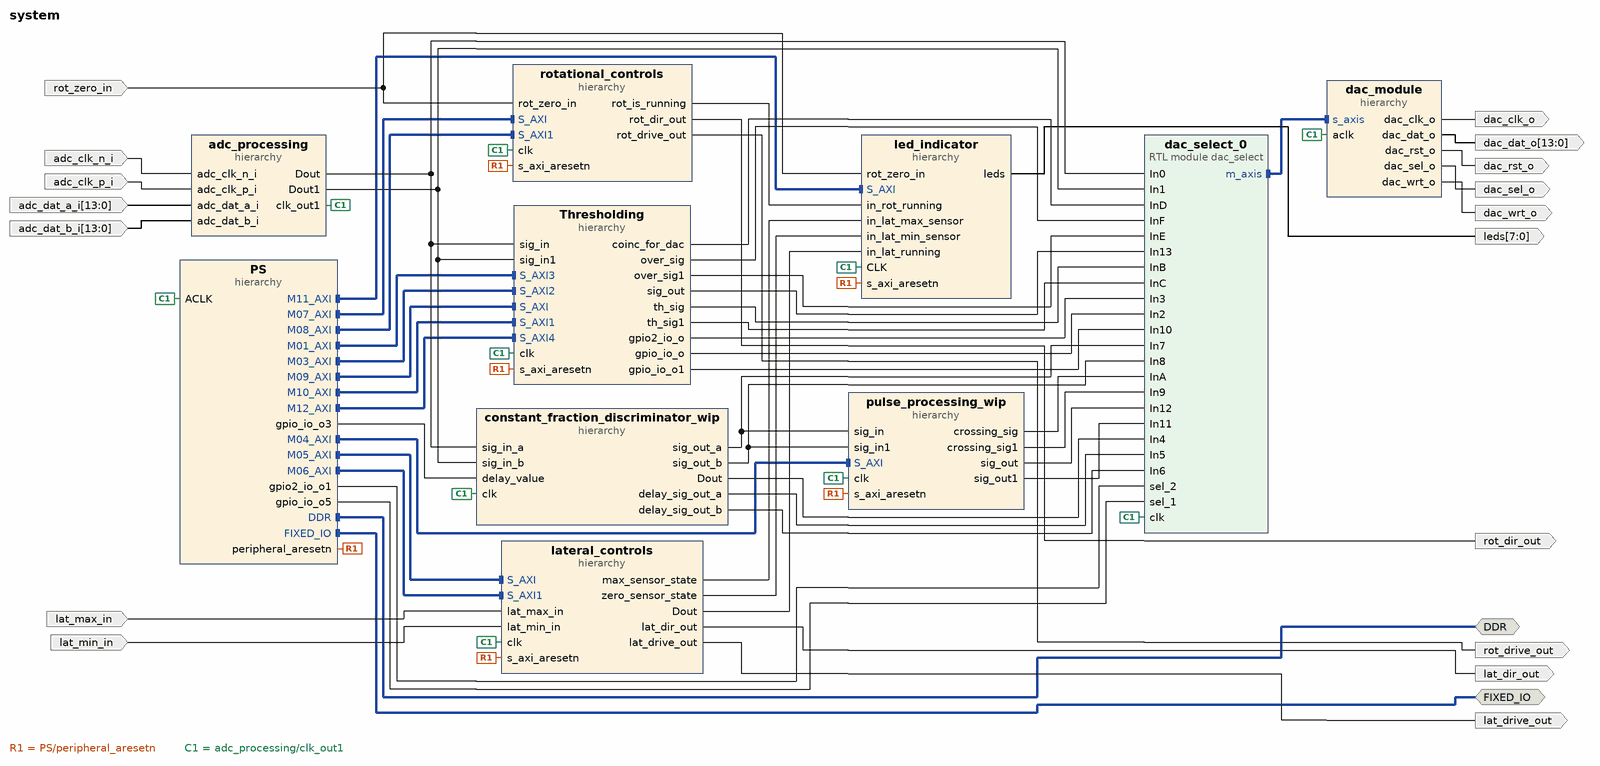
[diagram p0: block diagram of the top level]
# Vivado block design system, xc7z010clg400-1, Vivado 2024.1
create_bd_design system

create_bd_intf_port -mode Master -vlnv xilinx.com:interface:ddrx_rtl:1.0 DDR
create_bd_intf_port -mode Master -vlnv xilinx.com:display_processing_system7:fixedio_rtl:1.0 FIXED_IO
create_bd_port -dir O dac_clk_o
create_bd_port -dir O dac_rst_o
create_bd_port -dir O dac_sel_o
create_bd_port -dir O dac_wrt_o
create_bd_port -dir O -from 13 -to 0 dac_dat_o
create_bd_port -dir I -from 13 -to 0 adc_dat_a_i
create_bd_port -dir I -from 13 -to 0 adc_dat_b_i
create_bd_port -dir I -type clk adc_clk_p_i
set_property -dict {CONFIG.FREQ_HZ 125000000} [get_bd_ports adc_clk_p_i]
create_bd_port -dir I -type clk adc_clk_n_i
set_property -dict {CONFIG.FREQ_HZ 125000000} [get_bd_ports adc_clk_n_i]
create_bd_port -dir I lat_max_in
create_bd_port -dir I lat_min_in
create_bd_port -dir O lat_drive_out
create_bd_port -dir O lat_dir_out
create_bd_port -dir O -from 7 -to 0 leds
create_bd_port -dir O rot_drive_out
create_bd_port -dir O rot_dir_out
create_bd_port -dir I rot_zero_in

create_bd_cell -type hier dac_module
create_bd_cell -type hier constant_fraction_discriminator_wip
create_bd_cell -type hier Thresholding
create_bd_cell -type hier PS
create_bd_cell -type module -reference dac_select dac_select_0
set_property -dict {CONFIG.CHANNELS_IN 16} [get_bd_cells dac_select_0]
create_bd_cell -type hier lateral_controls
create_bd_cell -type hier rotational_controls
create_bd_cell -type hier pulse_processing_wip
create_bd_cell -type hier adc_processing
create_bd_cell -type hier led_indicator

# ---- hierarchy /dac_module ----
current_bd_instance /dac_module
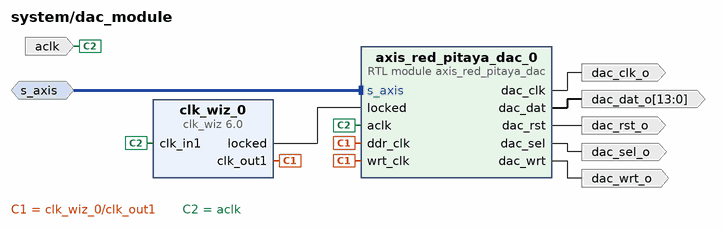
[diagram p1: block diagram inside /dac_module]
create_bd_intf_pin -mode Slave -vlnv xilinx.com:interface:axis_rtl:1.0 s_axis
create_bd_pin -dir I -type clk aclk
create_bd_pin -dir O -type clk dac_clk_o
create_bd_pin -dir O -type rst dac_rst_o
create_bd_pin -dir O dac_sel_o
create_bd_pin -dir O dac_wrt_o
create_bd_pin -dir O -from 13 -to 0 dac_dat_o

create_bd_cell -type ip -vlnv xilinx.com:ip:clk_wiz:6.0 clk_wiz_0
set_property -dict [list \
  CONFIG.CLKIN1_JITTER_PS 80.0 \
  CONFIG.CLKOUT1_DRIVES BUFG \
  CONFIG.CLKOUT1_JITTER 104.759 \
  CONFIG.CLKOUT1_PHASE_ERROR 96.948 \
  CONFIG.CLKOUT1_REQUESTED_OUT_FREQ 250 \
  CONFIG.CLKOUT2_DRIVES BUFG \
  CONFIG.CLKOUT3_DRIVES BUFG \
  CONFIG.CLKOUT4_DRIVES BUFG \
  CONFIG.CLKOUT5_DRIVES BUFG \
  CONFIG.CLKOUT6_DRIVES BUFG \
  CONFIG.CLKOUT7_DRIVES BUFG \
  CONFIG.FEEDBACK_SOURCE FDBK_AUTO \
  CONFIG.MMCM_BANDWIDTH OPTIMIZED \
  CONFIG.MMCM_CLKFBOUT_MULT_F 8.000 \
  CONFIG.MMCM_CLKIN1_PERIOD 8.000 \
  CONFIG.MMCM_CLKIN2_PERIOD 10.000 \
  CONFIG.MMCM_CLKOUT0_DIVIDE_F 4.000 \
  CONFIG.MMCM_COMPENSATION ZHOLD \
  CONFIG.PRIMITIVE MMCM \
  CONFIG.PRIM_IN_FREQ 125 \
  CONFIG.USE_RESET false \
] [get_bd_cells clk_wiz_0]
create_bd_cell -type module -reference axis_red_pitaya_dac axis_red_pitaya_dac_0

# ---- hierarchy /constant_fraction_discriminator_wip ----
current_bd_instance /constant_fraction_discriminator_wip
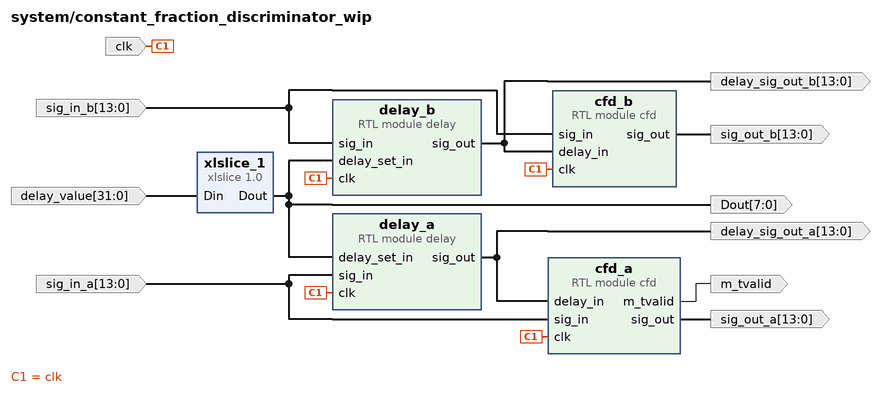
[diagram p2: block diagram inside /constant_fraction_discriminator_wip]
create_bd_pin -dir I -type clk clk
create_bd_pin -dir I -from 13 -to 0 sig_in_a
create_bd_pin -dir O -from 13 -to 0 sig_out_a
create_bd_pin -dir O m_tvalid
create_bd_pin -dir I -from 31 -to 0 delay_value
create_bd_pin -dir I -from 13 -to 0 sig_in_b
create_bd_pin -dir O -from 13 -to 0 sig_out_b
create_bd_pin -dir O -from 7 -to 0 Dout
create_bd_pin -dir O -from 13 -to 0 delay_sig_out_a
create_bd_pin -dir O -from 13 -to 0 delay_sig_out_b

create_bd_cell -type module -reference cfd cfd_a
create_bd_cell -type module -reference delay delay_a
create_bd_cell -type ip -vlnv xilinx.com:ip:xlslice:1.0 xlslice_1
set_property -dict {CONFIG.DIN_FROM 7 CONFIG.DOUT_WIDTH 8} [get_bd_cells xlslice_1]
create_bd_cell -type module -reference delay delay_b
create_bd_cell -type module -reference cfd cfd_b

# ---- hierarchy /Thresholding ----
current_bd_instance /Thresholding
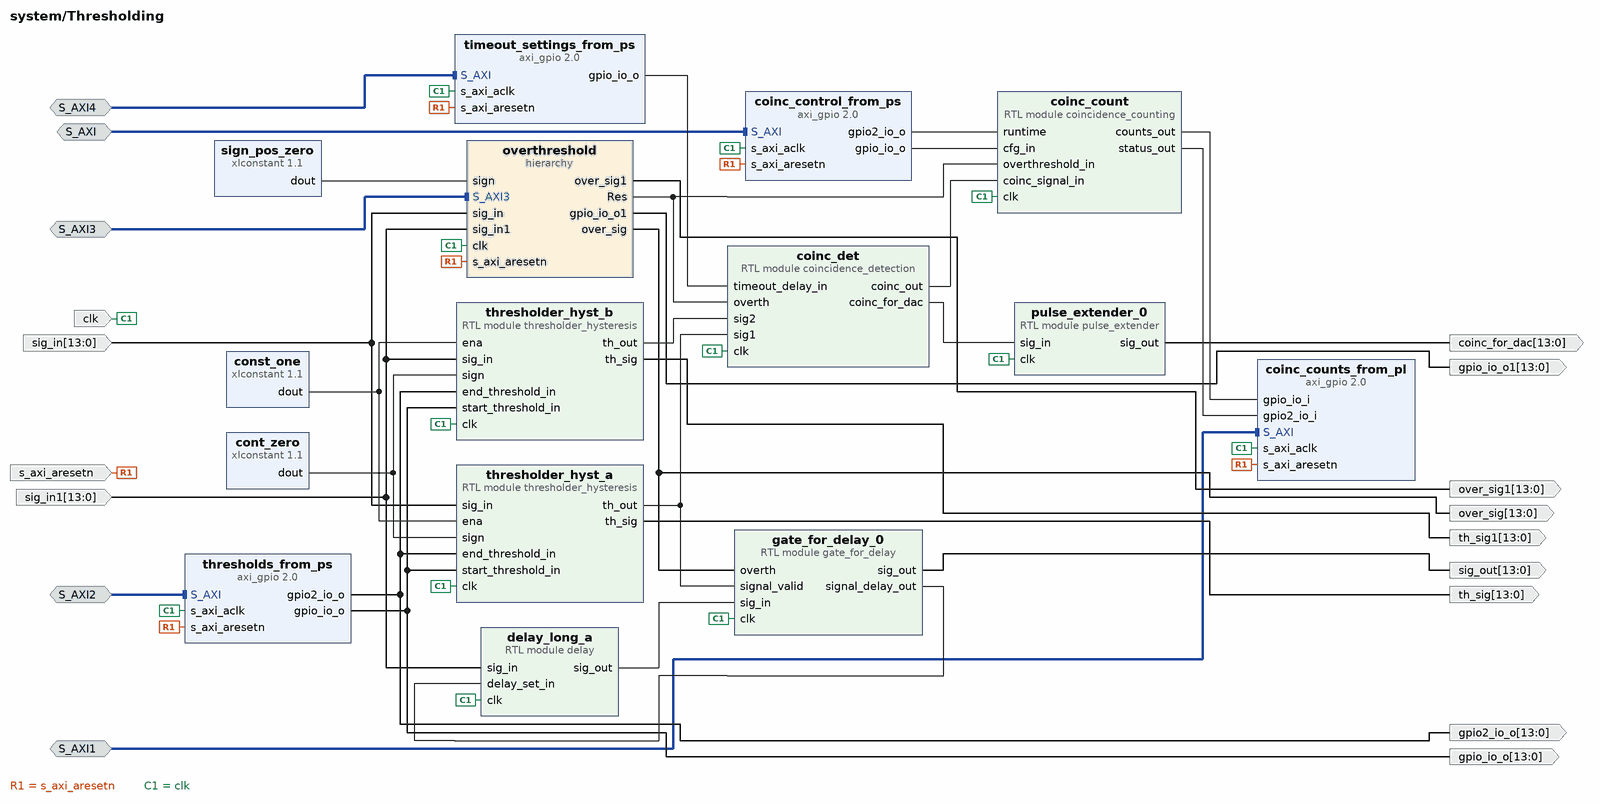
[diagram p3: block diagram inside /Thresholding]
create_bd_intf_pin -mode Slave -vlnv xilinx.com:interface:aximm_rtl:1.0 S_AXI
create_bd_intf_pin -mode Slave -vlnv xilinx.com:interface:aximm_rtl:1.0 S_AXI1
create_bd_intf_pin -mode Slave -vlnv xilinx.com:interface:aximm_rtl:1.0 S_AXI2
create_bd_intf_pin -mode Slave -vlnv xilinx.com:interface:aximm_rtl:1.0 S_AXI3
create_bd_intf_pin -mode Slave -vlnv xilinx.com:interface:aximm_rtl:1.0 S_AXI4
create_bd_pin -dir I -type clk clk
create_bd_pin -dir I -from 13 -to 0 sig_in
create_bd_pin -dir O -from 13 -to 0 th_sig
create_bd_pin -dir I -from 13 -to 0 sig_in1
create_bd_pin -dir O -from 13 -to 0 th_sig1
create_bd_pin -dir O -from 13 -to 0 coinc_for_dac
create_bd_pin -dir O -from 13 -to 0 over_sig
create_bd_pin -dir O -from 13 -to 0 over_sig1
create_bd_pin -dir I -type rst s_axi_aresetn
create_bd_pin -dir O -from 13 -to 0 sig_out
create_bd_pin -dir O -from 13 -to 0 gpio_io_o
create_bd_pin -dir O -from 13 -to 0 gpio2_io_o
create_bd_pin -dir O -from 13 -to 0 gpio_io_o1

create_bd_cell -type ip -vlnv xilinx.com:ip:xlconstant:1.1 const_one
create_bd_cell -type module -reference thresholder_hysteresis thresholder_hyst_a
create_bd_cell -type module -reference thresholder_hysteresis thresholder_hyst_b
create_bd_cell -type ip -vlnv xilinx.com:ip:xlconstant:1.1 cont_zero
set_property -dict {CONFIG.CONST_VAL 0} [get_bd_cells cont_zero]
create_bd_cell -type module -reference coincidence_detection coinc_det
create_bd_cell -type module -reference pulse_extender pulse_extender_0
create_bd_cell -type hier overthreshold
create_bd_cell -type module -reference coincidence_counting coinc_count
create_bd_cell -type ip -vlnv xilinx.com:ip:axi_gpio:2.0 coinc_control_from_ps
set_property -dict {CONFIG.C_ALL_OUTPUTS 1 CONFIG.C_ALL_OUTPUTS_2 1 CONFIG.C_IS_DUAL 1} [get_bd_cells coinc_control_from_ps]
create_bd_cell -type ip -vlnv xilinx.com:ip:axi_gpio:2.0 coinc_counts_from_pl
set_property -dict {CONFIG.C_ALL_INPUTS 1 CONFIG.C_ALL_INPUTS_2 1 CONFIG.C_IS_DUAL 1} [get_bd_cells coinc_counts_from_pl]
create_bd_cell -type module -reference delay delay_long_a
create_bd_cell -type module -reference gate_for_delay gate_for_delay_0
set_property -dict {CONFIG.DELAY_VALUE 500} [get_bd_cells gate_for_delay_0]
create_bd_cell -type ip -vlnv xilinx.com:ip:xlconstant:1.1 sign_pos_zero
set_property -dict {CONFIG.CONST_VAL 0} [get_bd_cells sign_pos_zero]
create_bd_cell -type ip -vlnv xilinx.com:ip:axi_gpio:2.0 thresholds_from_ps
set_property -dict [list \
  CONFIG.C_ALL_OUTPUTS 1 \
  CONFIG.C_ALL_OUTPUTS_2 1 \
  CONFIG.C_DOUT_DEFAULT 0x00000FFF \
  CONFIG.C_DOUT_DEFAULT_2 0x00000EFF \
  CONFIG.C_GPIO2_WIDTH 14 \
  CONFIG.C_GPIO_WIDTH 14 \
  CONFIG.C_IS_DUAL 1 \
] [get_bd_cells thresholds_from_ps]
create_bd_cell -type ip -vlnv xilinx.com:ip:axi_gpio:2.0 timeout_settings_from_ps
set_property -dict [list \
  CONFIG.C_ALL_OUTPUTS 1 \
  CONFIG.C_DOUT_DEFAULT 0x0000000F \
  CONFIG.C_GPIO_WIDTH 8 \
] [get_bd_cells timeout_settings_from_ps]

# ---- hierarchy /Thresholding/overthreshold ----
current_bd_instance /Thresholding/overthreshold
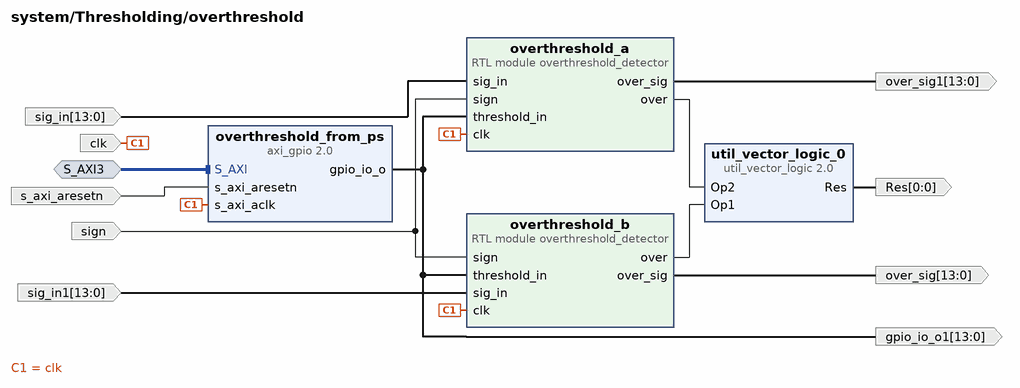
[diagram p4: block diagram inside /Thresholding/overthreshold]
create_bd_intf_pin -mode Slave -vlnv xilinx.com:interface:aximm_rtl:1.0 S_AXI3
create_bd_pin -dir I -type clk clk
create_bd_pin -dir I -from 13 -to 0 sig_in1
create_bd_pin -dir I sign
create_bd_pin -dir O -from 13 -to 0 over_sig
create_bd_pin -dir O -from 0 -to 0 Res
create_bd_pin -dir I -from 13 -to 0 sig_in
create_bd_pin -dir O -from 13 -to 0 over_sig1
create_bd_pin -dir I -type rst s_axi_aresetn
create_bd_pin -dir O -from 13 -to 0 gpio_io_o1

create_bd_cell -type module -reference overthreshold_detector overthreshold_b
create_bd_cell -type ip -vlnv xilinx.com:ip:util_vector_logic:2.0 util_vector_logic_0
set_property -dict {CONFIG.C_OPERATION or CONFIG.C_SIZE 1} [get_bd_cells util_vector_logic_0]
create_bd_cell -type module -reference overthreshold_detector overthreshold_a
create_bd_cell -type ip -vlnv xilinx.com:ip:axi_gpio:2.0 overthreshold_from_ps
set_property -dict [list \
  CONFIG.C_ALL_OUTPUTS 1 \
  CONFIG.C_DOUT_DEFAULT 0x00001E00 \
  CONFIG.C_GPIO_WIDTH 14 \
] [get_bd_cells overthreshold_from_ps]

# ---- hierarchy /PS ----
current_bd_instance /PS
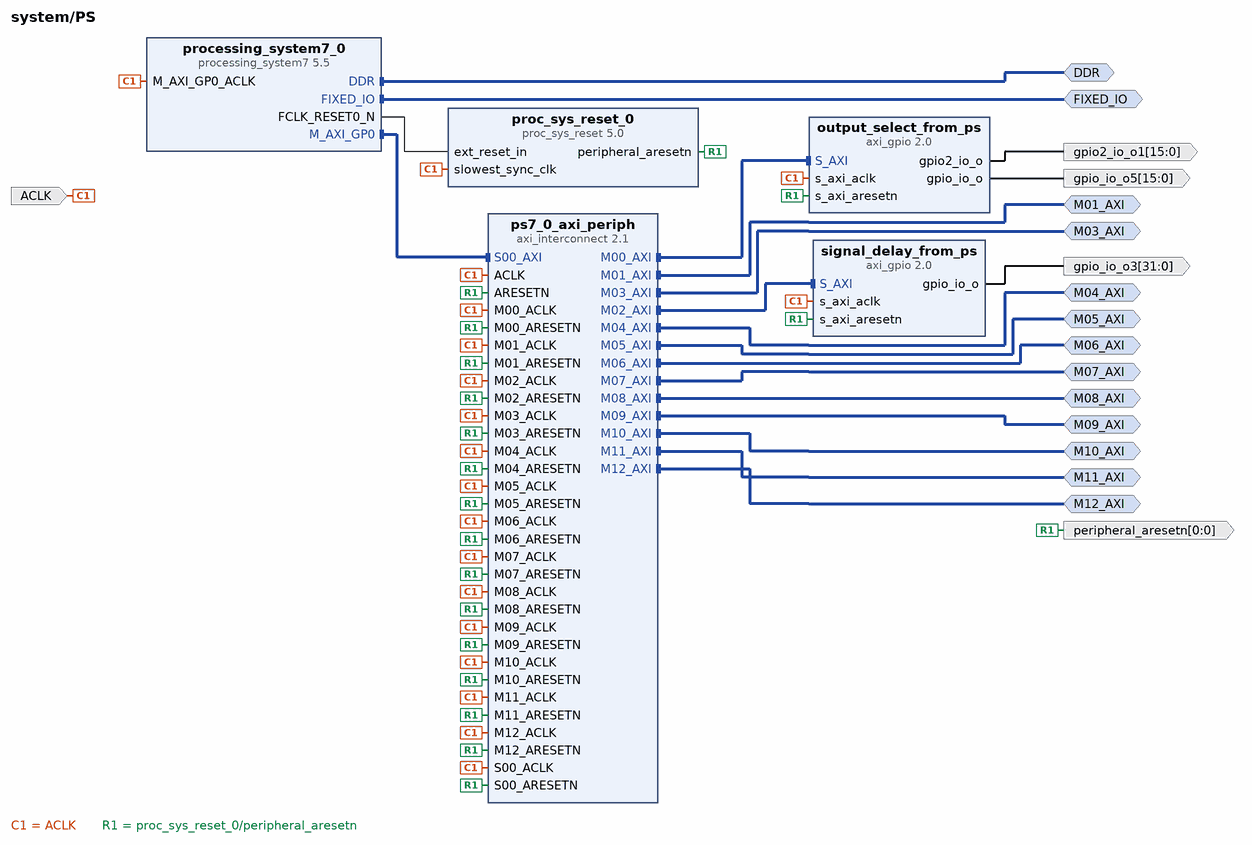
[diagram p5: block diagram inside /PS]
create_bd_intf_pin -mode Master -vlnv xilinx.com:interface:ddrx_rtl:1.0 DDR
create_bd_intf_pin -mode Master -vlnv xilinx.com:display_processing_system7:fixedio_rtl:1.0 FIXED_IO
create_bd_intf_pin -mode Master -vlnv xilinx.com:interface:aximm_rtl:1.0 M05_AXI
create_bd_intf_pin -mode Master -vlnv xilinx.com:interface:aximm_rtl:1.0 M06_AXI
create_bd_intf_pin -mode Master -vlnv xilinx.com:interface:aximm_rtl:1.0 M07_AXI
create_bd_intf_pin -mode Master -vlnv xilinx.com:interface:aximm_rtl:1.0 M08_AXI
create_bd_intf_pin -mode Master -vlnv xilinx.com:interface:aximm_rtl:1.0 M09_AXI
create_bd_intf_pin -mode Master -vlnv xilinx.com:interface:aximm_rtl:1.0 M10_AXI
create_bd_intf_pin -mode Master -vlnv xilinx.com:interface:aximm_rtl:1.0 M04_AXI
create_bd_intf_pin -mode Master -vlnv xilinx.com:interface:aximm_rtl:1.0 M11_AXI
create_bd_intf_pin -mode Master -vlnv xilinx.com:interface:aximm_rtl:1.0 M03_AXI
create_bd_intf_pin -mode Master -vlnv xilinx.com:interface:aximm_rtl:1.0 M01_AXI
create_bd_intf_pin -mode Master -vlnv xilinx.com:interface:aximm_rtl:1.0 M12_AXI
create_bd_pin -dir O -from 31 -to 0 gpio_io_o3
create_bd_pin -dir I -type clk ACLK
create_bd_pin -dir O -from 0 -to 0 -type rst peripheral_aresetn
create_bd_pin -dir O -from 15 -to 0 gpio2_io_o1
create_bd_pin -dir O -from 15 -to 0 gpio_io_o5

create_bd_cell -type ip -vlnv xilinx.com:ip:proc_sys_reset:5.0 proc_sys_reset_0
create_bd_cell -type ip -vlnv xilinx.com:ip:axi_gpio:2.0 output_select_from_ps
set_property -dict [list \
  CONFIG.C_ALL_OUTPUTS 1 \
  CONFIG.C_ALL_OUTPUTS_2 1 \
  CONFIG.C_DOUT_DEFAULT 0x00000000 \
  CONFIG.C_DOUT_DEFAULT_2 0x00000001 \
  CONFIG.C_GPIO2_WIDTH 16 \
  CONFIG.C_GPIO_WIDTH 16 \
  CONFIG.C_IS_DUAL 1 \
] [get_bd_cells output_select_from_ps]
create_bd_cell -type ip -vlnv xilinx.com:ip:processing_system7:5.5 processing_system7_0
set_property -dict [list \
  CONFIG.PCW_FPGA0_PERIPHERAL_FREQMHZ 125 \
  CONFIG.PCW_UIPARAM_DDR_FREQ_MHZ 533.333333 \
  CONFIG.PCW_UIPARAM_DDR_MEMORY_TYPE {DDR 3 (Low Voltage)} \
  CONFIG.PCW_UIPARAM_DDR_PARTNO {MT41K256M16 RE-125} \
] [get_bd_cells processing_system7_0]
# 34 more settings of processing_system7_0 are not shown: defaults, MIO pin electricals, DDR timing, and values the tool derives
create_bd_cell -type ip -vlnv xilinx.com:ip:axi_gpio:2.0 signal_delay_from_ps
set_property -dict [list \
  CONFIG.C_DOUT_DEFAULT 0x00000003 \
  CONFIG.C_IS_DUAL 0 \
  CONFIG.GPIO_BOARD_INTERFACE Custom \
  CONFIG.USE_BOARD_FLOW true \
] [get_bd_cells signal_delay_from_ps]
create_bd_cell -type ip -vlnv xilinx.com:ip:axi_interconnect:2.1 ps7_0_axi_periph
set_property -dict {CONFIG.NUM_MI 13} [get_bd_cells ps7_0_axi_periph]

# ---- hierarchy /lateral_controls ----
current_bd_instance /lateral_controls
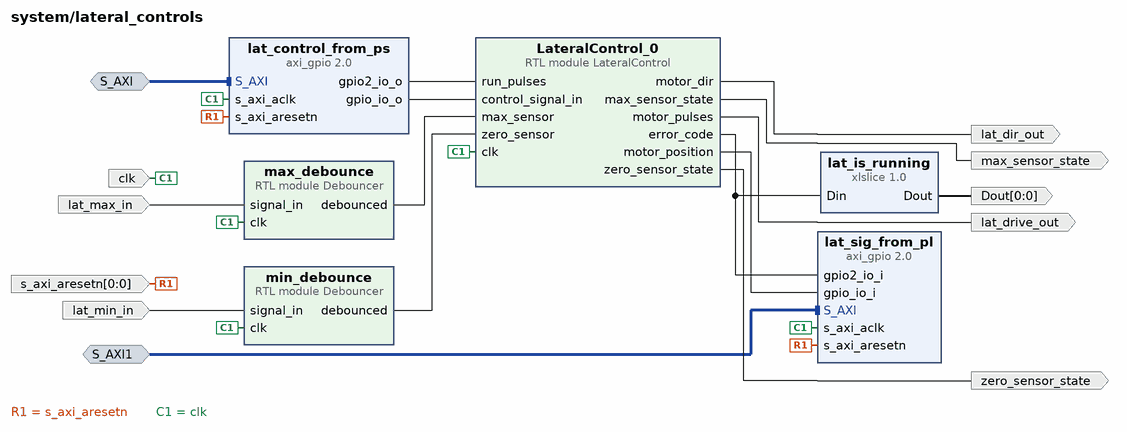
[diagram p6: block diagram inside /lateral_controls]
create_bd_intf_pin -mode Slave -vlnv xilinx.com:interface:aximm_rtl:1.0 S_AXI
create_bd_intf_pin -mode Slave -vlnv xilinx.com:interface:aximm_rtl:1.0 S_AXI1
create_bd_pin -dir I -type clk clk
create_bd_pin -dir O lat_drive_out
create_bd_pin -dir O lat_dir_out
create_bd_pin -dir O max_sensor_state
create_bd_pin -dir O zero_sensor_state
create_bd_pin -dir I lat_min_in
create_bd_pin -dir I lat_max_in
create_bd_pin -dir I -from 0 -to 0 -type rst s_axi_aresetn
create_bd_pin -dir O -from 0 -to 0 Dout

create_bd_cell -type module -reference LateralControl LateralControl_0
create_bd_cell -type module -reference Debouncer min_debounce
create_bd_cell -type module -reference Debouncer max_debounce
create_bd_cell -type ip -vlnv xilinx.com:ip:axi_gpio:2.0 lat_control_from_ps
set_property -dict {CONFIG.C_ALL_OUTPUTS 1 CONFIG.C_ALL_OUTPUTS_2 1 CONFIG.C_IS_DUAL 1} [get_bd_cells lat_control_from_ps]
create_bd_cell -type ip -vlnv xilinx.com:ip:axi_gpio:2.0 lat_sig_from_pl
set_property -dict [list \
  CONFIG.C_ALL_INPUTS 1 \
  CONFIG.C_ALL_INPUTS_2 1 \
  CONFIG.C_GPIO2_WIDTH 8 \
  CONFIG.C_IS_DUAL 1 \
] [get_bd_cells lat_sig_from_pl]
create_bd_cell -type ip -vlnv xilinx.com:ip:xlslice:1.0 lat_is_running
set_property -dict {CONFIG.DIN_WIDTH 8} [get_bd_cells lat_is_running]

# ---- hierarchy /rotational_controls ----
current_bd_instance /rotational_controls
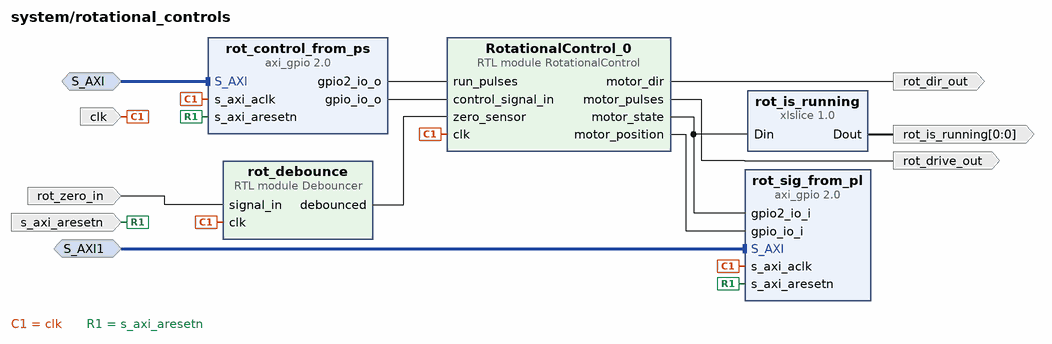
[diagram p7: block diagram inside /rotational_controls]
create_bd_intf_pin -mode Slave -vlnv xilinx.com:interface:aximm_rtl:1.0 S_AXI
create_bd_intf_pin -mode Slave -vlnv xilinx.com:interface:aximm_rtl:1.0 S_AXI1
create_bd_pin -dir O rot_dir_out
create_bd_pin -dir O rot_drive_out
create_bd_pin -dir I -type clk clk
create_bd_pin -dir I -type rst s_axi_aresetn
create_bd_pin -dir I rot_zero_in
create_bd_pin -dir O -from 0 -to 0 rot_is_running

create_bd_cell -type module -reference RotationalControl RotationalControl_0
create_bd_cell -type ip -vlnv xilinx.com:ip:axi_gpio:2.0 rot_control_from_ps
set_property -dict {CONFIG.C_ALL_OUTPUTS 1 CONFIG.C_ALL_OUTPUTS_2 1 CONFIG.C_IS_DUAL 1} [get_bd_cells rot_control_from_ps]
create_bd_cell -type ip -vlnv xilinx.com:ip:axi_gpio:2.0 rot_sig_from_pl
set_property -dict [list \
  CONFIG.C_ALL_INPUTS 1 \
  CONFIG.C_ALL_INPUTS_2 1 \
  CONFIG.C_GPIO2_WIDTH 7 \
  CONFIG.C_IS_DUAL 1 \
] [get_bd_cells rot_sig_from_pl]
create_bd_cell -type module -reference Debouncer rot_debounce
create_bd_cell -type ip -vlnv xilinx.com:ip:xlslice:1.0 rot_is_running
set_property -dict {CONFIG.DIN_WIDTH 6} [get_bd_cells rot_is_running]

# ---- hierarchy /pulse_processing_wip ----
current_bd_instance /pulse_processing_wip
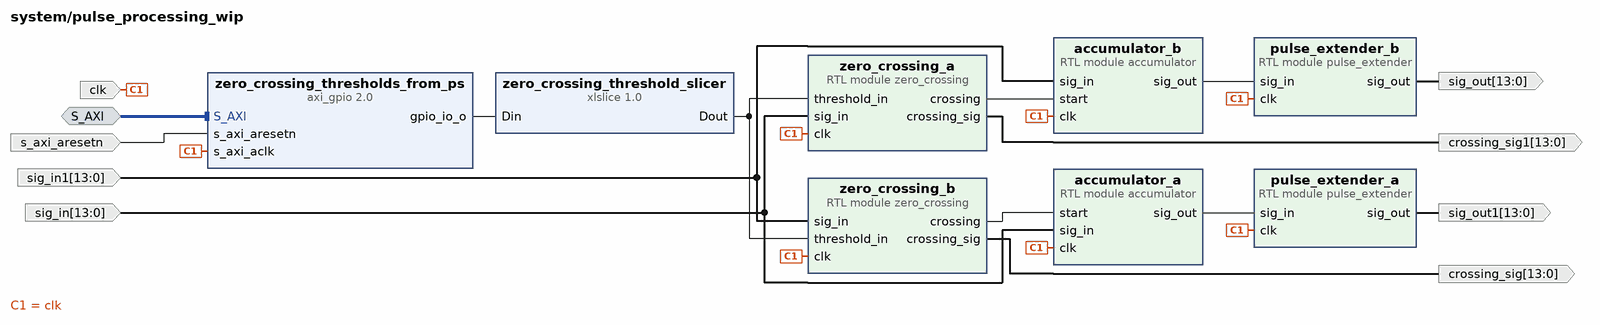
[diagram p8: block diagram inside /pulse_processing_wip]
create_bd_intf_pin -mode Slave -vlnv xilinx.com:interface:aximm_rtl:1.0 S_AXI
create_bd_pin -dir I -from 13 -to 0 sig_in
create_bd_pin -dir I -from 13 -to 0 sig_in1
create_bd_pin -dir O -from 13 -to 0 crossing_sig
create_bd_pin -dir O -from 13 -to 0 sig_out
create_bd_pin -dir O -from 13 -to 0 sig_out1
create_bd_pin -dir O -from 13 -to 0 crossing_sig1
create_bd_pin -dir I -type clk clk
create_bd_pin -dir I -type rst s_axi_aresetn

create_bd_cell -type module -reference zero_crossing zero_crossing_b
create_bd_cell -type module -reference accumulator accumulator_a
set_property -dict {CONFIG.DECIMATION_FACTOR 4 CONFIG.PADDING 4} [get_bd_cells accumulator_a]
create_bd_cell -type module -reference accumulator accumulator_b
set_property -dict {CONFIG.DECIMATION_FACTOR 4 CONFIG.PADDING 4} [get_bd_cells accumulator_b]
create_bd_cell -type module -reference pulse_extender pulse_extender_a
create_bd_cell -type module -reference pulse_extender pulse_extender_b
create_bd_cell -type module -reference zero_crossing zero_crossing_a
create_bd_cell -type ip -vlnv xilinx.com:ip:xlslice:1.0 zero_crossing_threshold_slicer
set_property -dict {CONFIG.DIN_FROM 13 CONFIG.DOUT_WIDTH 14} [get_bd_cells zero_crossing_threshold_slicer]
create_bd_cell -type ip -vlnv xilinx.com:ip:axi_gpio:2.0 zero_crossing_thresholds_from_ps
set_property -dict {CONFIG.C_DOUT_DEFAULT 0x000002FF} [get_bd_cells zero_crossing_thresholds_from_ps]

# ---- hierarchy /adc_processing ----
current_bd_instance /adc_processing
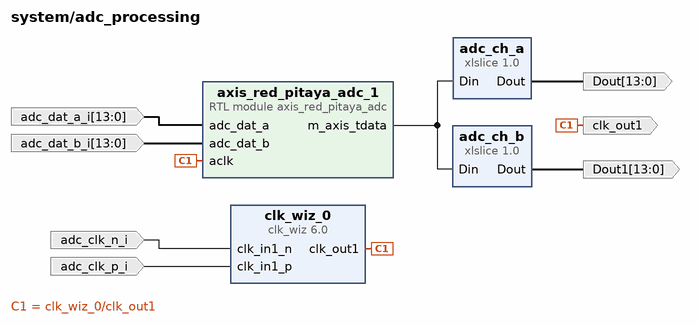
[diagram p9: block diagram inside /adc_processing]
create_bd_pin -dir O -from 13 -to 0 Dout
create_bd_pin -dir O -type clk clk_out1
create_bd_pin -dir I -from 13 -to 0 adc_dat_a_i
create_bd_pin -dir I -from 13 -to 0 adc_dat_b_i
create_bd_pin -dir I -type clk adc_clk_p_i
create_bd_pin -dir I -type clk adc_clk_n_i
create_bd_pin -dir O -from 13 -to 0 Dout1

create_bd_cell -type ip -vlnv xilinx.com:ip:xlslice:1.0 adc_ch_a
set_property -dict {CONFIG.DIN_FROM 13} [get_bd_cells adc_ch_a]
create_bd_cell -type module -reference axis_red_pitaya_adc axis_red_pitaya_adc_1
create_bd_cell -type ip -vlnv xilinx.com:ip:clk_wiz:6.0 clk_wiz_0
set_property -dict [list \
  CONFIG.CLKIN1_JITTER_PS 80.0 \
  CONFIG.CLKOUT1_DRIVES BUFG \
  CONFIG.CLKOUT1_JITTER 125.031 \
  CONFIG.CLKOUT1_PHASE_ERROR 104.065 \
  CONFIG.CLKOUT1_REQUESTED_OUT_FREQ 125 \
  CONFIG.CLKOUT2_DRIVES BUFG \
  CONFIG.CLKOUT3_DRIVES BUFG \
  CONFIG.CLKOUT4_DRIVES BUFG \
  CONFIG.CLKOUT5_DRIVES BUFG \
  CONFIG.CLKOUT6_DRIVES BUFG \
  CONFIG.CLKOUT7_DRIVES BUFG \
  CONFIG.MMCM_BANDWIDTH OPTIMIZED \
  CONFIG.MMCM_CLKFBOUT_MULT_F 7 \
  CONFIG.MMCM_CLKIN1_PERIOD 8.000 \
  CONFIG.MMCM_CLKIN2_PERIOD 10.0 \
  CONFIG.MMCM_CLKOUT0_DIVIDE_F 7 \
  CONFIG.MMCM_COMPENSATION ZHOLD \
  CONFIG.MMCM_DIVCLK_DIVIDE 1 \
  CONFIG.PLL_CLKIN_PERIOD 8.000 \
  CONFIG.PRIMITIVE PLL \
  CONFIG.PRIM_IN_FREQ 125 \
  CONFIG.PRIM_SOURCE Differential_clock_capable_pin \
  CONFIG.USE_LOCKED false \
  CONFIG.USE_RESET false \
] [get_bd_cells clk_wiz_0]
create_bd_cell -type ip -vlnv xilinx.com:ip:xlslice:1.0 adc_ch_b
set_property -dict {CONFIG.DIN_FROM 29 CONFIG.DIN_TO 16} [get_bd_cells adc_ch_b]

# ---- hierarchy /led_indicator ----
current_bd_instance /led_indicator
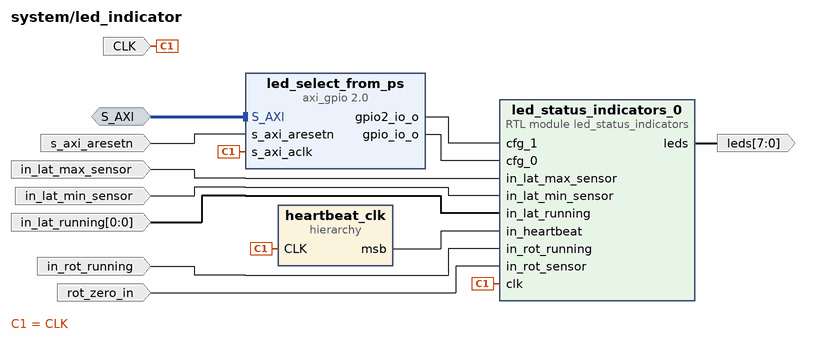
[diagram p10: block diagram inside /led_indicator]
create_bd_intf_pin -mode Slave -vlnv xilinx.com:interface:aximm_rtl:1.0 S_AXI
create_bd_pin -dir I -type clk CLK
create_bd_pin -dir I in_lat_min_sensor
create_bd_pin -dir I in_lat_max_sensor
create_bd_pin -dir O -from 7 -to 0 leds
create_bd_pin -dir I rot_zero_in
create_bd_pin -dir I in_rot_running
create_bd_pin -dir I -from 0 -to 0 in_lat_running
create_bd_pin -dir I -type rst s_axi_aresetn

create_bd_cell -type module -reference led_status_indicators led_status_indicators_0
create_bd_cell -type hier heartbeat_clk
create_bd_cell -type ip -vlnv xilinx.com:ip:axi_gpio:2.0 led_select_from_ps
set_property -dict {CONFIG.C_ALL_OUTPUTS 1 CONFIG.C_ALL_OUTPUTS_2 1 CONFIG.C_IS_DUAL 1} [get_bd_cells led_select_from_ps]

# ---- hierarchy /led_indicator/heartbeat_clk ----
current_bd_instance /led_indicator/heartbeat_clk
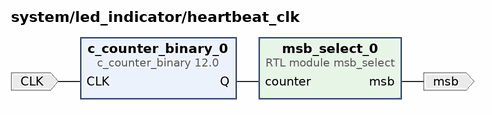
[diagram p11: block diagram inside /led_indicator/heartbeat_clk]
create_bd_pin -dir O msb
create_bd_pin -dir I -type clk CLK

create_bd_cell -type module -reference msb_select msb_select_0
create_bd_cell -type ip -vlnv xilinx.com:ip:c_counter_binary:12.0 c_counter_binary_0
set_property -dict {CONFIG.Implementation Fabric CONFIG.Output_Width 28} [get_bd_cells c_counter_binary_0]

# ---- connections ----

current_bd_instance /dac_module
connect_bd_intf_net [get_bd_intf_pins axis_red_pitaya_dac_0/s_axis] [get_bd_intf_pins s_axis]
connect_bd_net [get_bd_pins axis_red_pitaya_dac_0/dac_clk] [get_bd_pins dac_clk_o]
connect_bd_net [get_bd_pins axis_red_pitaya_dac_0/dac_dat] [get_bd_pins dac_dat_o]
connect_bd_net [get_bd_pins axis_red_pitaya_dac_0/dac_rst] [get_bd_pins dac_rst_o]
connect_bd_net [get_bd_pins axis_red_pitaya_dac_0/dac_sel] [get_bd_pins dac_sel_o]
connect_bd_net [get_bd_pins axis_red_pitaya_dac_0/dac_wrt] [get_bd_pins dac_wrt_o]
connect_bd_net [get_bd_pins clk_wiz_0/clk_out1] [get_bd_pins axis_red_pitaya_dac_0/ddr_clk] [get_bd_pins axis_red_pitaya_dac_0/wrt_clk]
connect_bd_net [get_bd_pins clk_wiz_0/locked] [get_bd_pins axis_red_pitaya_dac_0/locked]
connect_bd_net -net processing_system7_0_FCLK_CLK0 [get_bd_pins aclk] [get_bd_pins axis_red_pitaya_dac_0/aclk] [get_bd_pins clk_wiz_0/clk_in1]

current_bd_instance /constant_fraction_discriminator_wip
connect_bd_net -net Din_1 [get_bd_pins delay_value] [get_bd_pins xlslice_1/Din]
connect_bd_net -net adc_dat_b_i_1 [get_bd_pins sig_in_b] [get_bd_pins delay_b/sig_in] [get_bd_pins cfd_b/sig_in]
connect_bd_net -net cfd_0_sig_out [get_bd_pins cfd_b/sig_out] [get_bd_pins sig_out_b]
connect_bd_net -net cfd_1_m_tvalid [get_bd_pins cfd_a/m_tvalid] [get_bd_pins m_tvalid]
connect_bd_net -net cfd_1_sig_out [get_bd_pins cfd_a/sig_out] [get_bd_pins sig_out_a]
connect_bd_net -net delay_0_sig_out [get_bd_pins delay_a/sig_out] [get_bd_pins delay_sig_out_a] [get_bd_pins cfd_a/delay_in]
connect_bd_net [get_bd_pins delay_b/sig_out] [get_bd_pins delay_sig_out_b] [get_bd_pins cfd_b/delay_in]
connect_bd_net -net util_ds_buf_0_IBUF_OUT [get_bd_pins clk] \
  [get_bd_pins delay_a/clk] [get_bd_pins delay_b/clk] [get_bd_pins cfd_b/clk] [get_bd_pins cfd_a/clk]
connect_bd_net -net xlslice_0_Dout [get_bd_pins sig_in_a] [get_bd_pins delay_a/sig_in] [get_bd_pins cfd_a/sig_in]
connect_bd_net [get_bd_pins xlslice_1/Dout] [get_bd_pins delay_a/delay_set_in] [get_bd_pins delay_b/delay_set_in] [get_bd_pins Dout]

current_bd_instance /Thresholding
connect_bd_intf_net -intf_net S_AXI1_1 [get_bd_intf_pins S_AXI1] [get_bd_intf_pins coinc_counts_from_pl/S_AXI]
connect_bd_intf_net -intf_net S_AXI2_1 [get_bd_intf_pins S_AXI2] [get_bd_intf_pins thresholds_from_ps/S_AXI]
connect_bd_intf_net -intf_net S_AXI3_1 [get_bd_intf_pins S_AXI3] [get_bd_intf_pins overthreshold/S_AXI3]
connect_bd_intf_net -intf_net S_AXI4_1 [get_bd_intf_pins S_AXI4] [get_bd_intf_pins timeout_settings_from_ps/S_AXI]
connect_bd_intf_net [get_bd_intf_pins S_AXI] [get_bd_intf_pins coinc_control_from_ps/S_AXI]
connect_bd_net -net adc_dat_a_i_1 [get_bd_pins sig_in] [get_bd_pins overthreshold/sig_in] [get_bd_pins thresholder_hyst_a/sig_in]
connect_bd_net -net adc_dat_b_i_1 [get_bd_pins sig_in1] \
  [get_bd_pins overthreshold/sig_in1] [get_bd_pins thresholder_hyst_b/sig_in] [get_bd_pins delay_long_a/sig_in]
connect_bd_net -net axi_gpio_0_gpio2_io_o [get_bd_pins coinc_control_from_ps/gpio2_io_o] [get_bd_pins coinc_count/runtime]
connect_bd_net -net axi_gpio_0_gpio_io_o [get_bd_pins coinc_control_from_ps/gpio_io_o] [get_bd_pins coinc_count/cfg_in]
connect_bd_net -net axi_gpio_1_gpio2_io_o [get_bd_pins thresholds_from_ps/gpio2_io_o] \
  [get_bd_pins thresholder_hyst_a/end_threshold_in] [get_bd_pins thresholder_hyst_b/end_threshold_in] \
  [get_bd_pins gpio2_io_o]
connect_bd_net -net axi_gpio_1_gpio_io_o [get_bd_pins thresholds_from_ps/gpio_io_o] \
  [get_bd_pins thresholder_hyst_a/start_threshold_in] [get_bd_pins thresholder_hyst_b/start_threshold_in] \
  [get_bd_pins gpio_io_o]
connect_bd_net [get_bd_pins coinc_count/counts_out] [get_bd_pins coinc_counts_from_pl/gpio_io_i]
connect_bd_net [get_bd_pins coinc_count/status_out] [get_bd_pins coinc_counts_from_pl/gpio2_io_i]
connect_bd_net -net coincidence_detection_0_coinc_for_dac [get_bd_pins coinc_det/coinc_for_dac] [get_bd_pins pulse_extender_0/sig_in]
connect_bd_net -net coincidence_detection_0_coinc_out [get_bd_pins coinc_det/coinc_out] [get_bd_pins coinc_count/coinc_signal_in]
connect_bd_net [get_bd_pins delay_long_a/sig_out] [get_bd_pins gate_for_delay_0/sig_in]
connect_bd_net [get_bd_pins gate_for_delay_0/sig_out] [get_bd_pins sig_out]
connect_bd_net [get_bd_pins gate_for_delay_0/signal_delay_out] [get_bd_pins delay_long_a/delay_set_in]
connect_bd_net -net overthreshold_a_over_sig [get_bd_pins overthreshold/over_sig1] [get_bd_pins over_sig1]
connect_bd_net -net overthreshold_b_over_sig [get_bd_pins overthreshold/over_sig] [get_bd_pins over_sig] [get_bd_pins gate_for_delay_0/overth]
connect_bd_net [get_bd_pins pulse_extender_0/sig_out] [get_bd_pins coinc_for_dac]
connect_bd_net [get_bd_pins s_axi_aresetn] \
  [get_bd_pins coinc_control_from_ps/s_axi_aresetn] [get_bd_pins coinc_counts_from_pl/s_axi_aresetn] \
  [get_bd_pins thresholds_from_ps/s_axi_aresetn] [get_bd_pins overthreshold/s_axi_aresetn] \
  [get_bd_pins timeout_settings_from_ps/s_axi_aresetn]
connect_bd_net -net sign_1 [get_bd_pins sign_pos_zero/dout] [get_bd_pins overthreshold/sign]
connect_bd_net -net threshold_in_1 [get_bd_pins overthreshold/gpio_io_o1] [get_bd_pins gpio_io_o1]
connect_bd_net [get_bd_pins thresholder_hyst_a/th_out] [get_bd_pins gate_for_delay_0/signal_valid] [get_bd_pins coinc_det/sig1]
connect_bd_net [get_bd_pins thresholder_hyst_a/th_sig] [get_bd_pins th_sig]
connect_bd_net [get_bd_pins thresholder_hyst_b/th_out] [get_bd_pins coinc_det/sig2]
connect_bd_net [get_bd_pins thresholder_hyst_b/th_sig] [get_bd_pins th_sig1]
connect_bd_net [get_bd_pins timeout_settings_from_ps/gpio_io_o] [get_bd_pins coinc_det/timeout_delay_in]
connect_bd_net -net util_ds_buf_0_IBUF_OUT [get_bd_pins clk] \
  [get_bd_pins overthreshold/clk] [get_bd_pins thresholder_hyst_a/clk] [get_bd_pins thresholder_hyst_b/clk] \
  [get_bd_pins pulse_extender_0/clk] [get_bd_pins coinc_control_from_ps/s_axi_aclk] \
  [get_bd_pins coinc_counts_from_pl/s_axi_aclk] [get_bd_pins delay_long_a/clk] [get_bd_pins gate_for_delay_0/clk] \
  [get_bd_pins thresholds_from_ps/s_axi_aclk] [get_bd_pins coinc_det/clk] [get_bd_pins timeout_settings_from_ps/s_axi_aclk] \
  [get_bd_pins coinc_count/clk]
connect_bd_net -net util_vector_logic_0_Res [get_bd_pins overthreshold/Res] [get_bd_pins coinc_det/overth] [get_bd_pins coinc_count/overthreshold_in]
connect_bd_net -net xlconstant_0_dout [get_bd_pins const_one/dout] [get_bd_pins thresholder_hyst_a/ena] [get_bd_pins thresholder_hyst_b/ena]
connect_bd_net -net xlconstant_1_dout [get_bd_pins cont_zero/dout] [get_bd_pins thresholder_hyst_a/sign] [get_bd_pins thresholder_hyst_b/sign]

current_bd_instance /Thresholding/overthreshold
connect_bd_intf_net [get_bd_intf_pins overthreshold_from_ps/S_AXI] [get_bd_intf_pins S_AXI3]
connect_bd_net -net adc_dat_a_i_1 [get_bd_pins sig_in] [get_bd_pins overthreshold_a/sig_in]
connect_bd_net -net adc_dat_b_i_1 [get_bd_pins sig_in1] [get_bd_pins overthreshold_b/sig_in]
connect_bd_net [get_bd_pins overthreshold_a/over] [get_bd_pins util_vector_logic_0/Op2]
connect_bd_net [get_bd_pins overthreshold_a/over_sig] [get_bd_pins over_sig1]
connect_bd_net [get_bd_pins overthreshold_b/over] [get_bd_pins util_vector_logic_0/Op1]
connect_bd_net [get_bd_pins overthreshold_b/over_sig] [get_bd_pins over_sig]
connect_bd_net [get_bd_pins s_axi_aresetn] [get_bd_pins overthreshold_from_ps/s_axi_aresetn]
connect_bd_net [get_bd_pins sign] [get_bd_pins overthreshold_a/sign] [get_bd_pins overthreshold_b/sign]
connect_bd_net -net threshold_in_1 [get_bd_pins overthreshold_from_ps/gpio_io_o] \
  [get_bd_pins overthreshold_a/threshold_in] [get_bd_pins overthreshold_b/threshold_in] [get_bd_pins gpio_io_o1]
connect_bd_net -net util_ds_buf_0_IBUF_OUT [get_bd_pins clk] \
  [get_bd_pins overthreshold_a/clk] [get_bd_pins overthreshold_b/clk] [get_bd_pins overthreshold_from_ps/s_axi_aclk]
connect_bd_net [get_bd_pins util_vector_logic_0/Res] [get_bd_pins Res]

current_bd_instance /PS
connect_bd_intf_net [get_bd_intf_pins DDR] [get_bd_intf_pins processing_system7_0/DDR]
connect_bd_intf_net [get_bd_intf_pins FIXED_IO] [get_bd_intf_pins processing_system7_0/FIXED_IO]
connect_bd_intf_net [get_bd_intf_pins processing_system7_0/M_AXI_GP0] [get_bd_intf_pins ps7_0_axi_periph/S00_AXI]
connect_bd_intf_net [get_bd_intf_pins ps7_0_axi_periph/M00_AXI] [get_bd_intf_pins output_select_from_ps/S_AXI]
connect_bd_intf_net [get_bd_intf_pins M01_AXI] [get_bd_intf_pins ps7_0_axi_periph/M01_AXI]
connect_bd_intf_net [get_bd_intf_pins ps7_0_axi_periph/M02_AXI] [get_bd_intf_pins signal_delay_from_ps/S_AXI]
connect_bd_intf_net [get_bd_intf_pins M03_AXI] [get_bd_intf_pins ps7_0_axi_periph/M03_AXI]
connect_bd_intf_net [get_bd_intf_pins M04_AXI] [get_bd_intf_pins ps7_0_axi_periph/M04_AXI]
connect_bd_intf_net [get_bd_intf_pins M05_AXI] [get_bd_intf_pins ps7_0_axi_periph/M05_AXI]
connect_bd_intf_net [get_bd_intf_pins M06_AXI] [get_bd_intf_pins ps7_0_axi_periph/M06_AXI]
connect_bd_intf_net [get_bd_intf_pins M07_AXI] [get_bd_intf_pins ps7_0_axi_periph/M07_AXI]
connect_bd_intf_net [get_bd_intf_pins M08_AXI] [get_bd_intf_pins ps7_0_axi_periph/M08_AXI]
connect_bd_intf_net [get_bd_intf_pins M09_AXI] [get_bd_intf_pins ps7_0_axi_periph/M09_AXI]
connect_bd_intf_net [get_bd_intf_pins M10_AXI] [get_bd_intf_pins ps7_0_axi_periph/M10_AXI]
connect_bd_intf_net [get_bd_intf_pins M11_AXI] [get_bd_intf_pins ps7_0_axi_periph/M11_AXI]
connect_bd_intf_net [get_bd_intf_pins M12_AXI] [get_bd_intf_pins ps7_0_axi_periph/M12_AXI]
connect_bd_net [get_bd_pins ACLK] \
  [get_bd_pins processing_system7_0/M_AXI_GP0_ACLK] [get_bd_pins proc_sys_reset_0/slowest_sync_clk] \
  [get_bd_pins output_select_from_ps/s_axi_aclk] [get_bd_pins signal_delay_from_ps/s_axi_aclk] \
  [get_bd_pins ps7_0_axi_periph/ACLK] [get_bd_pins ps7_0_axi_periph/S00_ACLK] [get_bd_pins ps7_0_axi_periph/M00_ACLK] \
  [get_bd_pins ps7_0_axi_periph/M01_ACLK] [get_bd_pins ps7_0_axi_periph/M02_ACLK] [get_bd_pins ps7_0_axi_periph/M03_ACLK] \
  [get_bd_pins ps7_0_axi_periph/M04_ACLK] [get_bd_pins ps7_0_axi_periph/M05_ACLK] [get_bd_pins ps7_0_axi_periph/M06_ACLK] \
  [get_bd_pins ps7_0_axi_periph/M07_ACLK] [get_bd_pins ps7_0_axi_periph/M08_ACLK] [get_bd_pins ps7_0_axi_periph/M09_ACLK] \
  [get_bd_pins ps7_0_axi_periph/M10_ACLK] [get_bd_pins ps7_0_axi_periph/M11_ACLK] [get_bd_pins ps7_0_axi_periph/M12_ACLK]
connect_bd_net [get_bd_pins output_select_from_ps/gpio2_io_o] [get_bd_pins gpio2_io_o1]
connect_bd_net [get_bd_pins output_select_from_ps/gpio_io_o] [get_bd_pins gpio_io_o5]
connect_bd_net [get_bd_pins proc_sys_reset_0/peripheral_aresetn] \
  [get_bd_pins output_select_from_ps/s_axi_aresetn] [get_bd_pins ps7_0_axi_periph/S00_ARESETN] \
  [get_bd_pins ps7_0_axi_periph/M00_ARESETN] [get_bd_pins ps7_0_axi_periph/ARESETN] \
  [get_bd_pins ps7_0_axi_periph/M01_ARESETN] [get_bd_pins signal_delay_from_ps/s_axi_aresetn] \
  [get_bd_pins ps7_0_axi_periph/M02_ARESETN] [get_bd_pins ps7_0_axi_periph/M03_ARESETN] \
  [get_bd_pins ps7_0_axi_periph/M04_ARESETN] [get_bd_pins peripheral_aresetn] [get_bd_pins ps7_0_axi_periph/M05_ARESETN] \
  [get_bd_pins ps7_0_axi_periph/M06_ARESETN] [get_bd_pins ps7_0_axi_periph/M07_ARESETN] \
  [get_bd_pins ps7_0_axi_periph/M08_ARESETN] [get_bd_pins ps7_0_axi_periph/M09_ARESETN] \
  [get_bd_pins ps7_0_axi_periph/M10_ARESETN] [get_bd_pins ps7_0_axi_periph/M11_ARESETN] \
  [get_bd_pins ps7_0_axi_periph/M12_ARESETN]
connect_bd_net [get_bd_pins processing_system7_0/FCLK_RESET0_N] [get_bd_pins proc_sys_reset_0/ext_reset_in]
connect_bd_net [get_bd_pins signal_delay_from_ps/gpio_io_o] [get_bd_pins gpio_io_o3]

current_bd_instance /lateral_controls
connect_bd_intf_net -intf_net S_AXI1_1 [get_bd_intf_pins S_AXI1] [get_bd_intf_pins lat_sig_from_pl/S_AXI]
connect_bd_intf_net [get_bd_intf_pins S_AXI] [get_bd_intf_pins lat_control_from_ps/S_AXI]
connect_bd_net -net Debouncer_0_debounced [get_bd_pins max_debounce/debounced] [get_bd_pins LateralControl_0/max_sensor]
connect_bd_net -net Debouncer_1_debounced [get_bd_pins min_debounce/debounced] [get_bd_pins LateralControl_0/zero_sensor]
connect_bd_net [get_bd_pins LateralControl_0/error_code] [get_bd_pins lat_sig_from_pl/gpio2_io_i] [get_bd_pins lat_is_running/Din]
connect_bd_net [get_bd_pins LateralControl_0/max_sensor_state] [get_bd_pins max_sensor_state]
connect_bd_net [get_bd_pins LateralControl_0/motor_dir] [get_bd_pins lat_dir_out]
connect_bd_net [get_bd_pins LateralControl_0/motor_position] [get_bd_pins lat_sig_from_pl/gpio_io_i]
connect_bd_net [get_bd_pins LateralControl_0/motor_pulses] [get_bd_pins lat_drive_out]
connect_bd_net [get_bd_pins LateralControl_0/zero_sensor_state] [get_bd_pins zero_sensor_state]
connect_bd_net -net axi_gpio_0_gpio2_io_o [get_bd_pins lat_control_from_ps/gpio2_io_o] [get_bd_pins LateralControl_0/run_pulses]
connect_bd_net -net axi_gpio_0_gpio_io_o [get_bd_pins lat_control_from_ps/gpio_io_o] [get_bd_pins LateralControl_0/control_signal_in]
connect_bd_net [get_bd_pins lat_is_running/Dout] [get_bd_pins Dout]
connect_bd_net [get_bd_pins lat_max_in] [get_bd_pins max_debounce/signal_in]
connect_bd_net [get_bd_pins lat_min_in] [get_bd_pins min_debounce/signal_in]
connect_bd_net [get_bd_pins s_axi_aresetn] [get_bd_pins lat_control_from_ps/s_axi_aresetn] [get_bd_pins lat_sig_from_pl/s_axi_aresetn]
connect_bd_net -net util_ds_buf_0_IBUF_OUT [get_bd_pins clk] \
  [get_bd_pins LateralControl_0/clk] [get_bd_pins lat_control_from_ps/s_axi_aclk] [get_bd_pins lat_sig_from_pl/s_axi_aclk] \
  [get_bd_pins max_debounce/clk] [get_bd_pins min_debounce/clk]

current_bd_instance /rotational_controls
connect_bd_intf_net -intf_net S_AXI1_1 [get_bd_intf_pins S_AXI1] [get_bd_intf_pins rot_sig_from_pl/S_AXI]
connect_bd_intf_net [get_bd_intf_pins S_AXI] [get_bd_intf_pins rot_control_from_ps/S_AXI]
connect_bd_net -net Debouncer_0_debounced [get_bd_pins rot_debounce/debounced] [get_bd_pins RotationalControl_0/zero_sensor]
connect_bd_net [get_bd_pins RotationalControl_0/motor_dir] [get_bd_pins rot_dir_out]
connect_bd_net [get_bd_pins RotationalControl_0/motor_position] [get_bd_pins rot_sig_from_pl/gpio_io_i]
connect_bd_net [get_bd_pins RotationalControl_0/motor_pulses] [get_bd_pins rot_drive_out]
connect_bd_net [get_bd_pins RotationalControl_0/motor_state] [get_bd_pins rot_sig_from_pl/gpio2_io_i] [get_bd_pins rot_is_running/Din]
connect_bd_net [get_bd_pins clk] \
  [get_bd_pins rot_control_from_ps/s_axi_aclk] [get_bd_pins rot_sig_from_pl/s_axi_aclk] [get_bd_pins RotationalControl_0/clk] \
  [get_bd_pins rot_debounce/clk]
connect_bd_net [get_bd_pins rot_control_from_ps/gpio2_io_o] [get_bd_pins RotationalControl_0/run_pulses]
connect_bd_net [get_bd_pins rot_control_from_ps/gpio_io_o] [get_bd_pins RotationalControl_0/control_signal_in]
connect_bd_net [get_bd_pins rot_is_running/Dout] [get_bd_pins rot_is_running]
connect_bd_net [get_bd_pins rot_zero_in] [get_bd_pins rot_debounce/signal_in]
connect_bd_net [get_bd_pins s_axi_aresetn] [get_bd_pins rot_control_from_ps/s_axi_aresetn] [get_bd_pins rot_sig_from_pl/s_axi_aresetn]

current_bd_instance /pulse_processing_wip
connect_bd_intf_net [get_bd_intf_pins S_AXI] [get_bd_intf_pins zero_crossing_thresholds_from_ps/S_AXI]
connect_bd_net [get_bd_pins accumulator_a/sig_out] [get_bd_pins pulse_extender_a/sig_in]
connect_bd_net [get_bd_pins accumulator_b/sig_out] [get_bd_pins pulse_extender_b/sig_in]
connect_bd_net [get_bd_pins clk] \
  [get_bd_pins accumulator_a/clk] [get_bd_pins pulse_extender_a/clk] [get_bd_pins zero_crossing_a/clk] \
  [get_bd_pins pulse_extender_b/clk] [get_bd_pins accumulator_b/clk] [get_bd_pins zero_crossing_b/clk] \
  [get_bd_pins zero_crossing_thresholds_from_ps/s_axi_aclk]
connect_bd_net [get_bd_pins pulse_extender_a/sig_out] [get_bd_pins sig_out1]
connect_bd_net [get_bd_pins pulse_extender_b/sig_out] [get_bd_pins sig_out]
connect_bd_net [get_bd_pins s_axi_aresetn] [get_bd_pins zero_crossing_thresholds_from_ps/s_axi_aresetn]
connect_bd_net -net sig_in1_1 [get_bd_pins sig_in1] [get_bd_pins accumulator_b/sig_in] [get_bd_pins zero_crossing_b/sig_in]
connect_bd_net [get_bd_pins sig_in] [get_bd_pins zero_crossing_a/sig_in] [get_bd_pins accumulator_a/sig_in]
connect_bd_net [get_bd_pins zero_crossing_a/crossing] [get_bd_pins accumulator_b/start]
connect_bd_net [get_bd_pins zero_crossing_a/crossing_sig] [get_bd_pins crossing_sig1]
connect_bd_net [get_bd_pins zero_crossing_b/crossing] [get_bd_pins accumulator_a/start]
connect_bd_net [get_bd_pins zero_crossing_b/crossing_sig] [get_bd_pins crossing_sig]
connect_bd_net [get_bd_pins zero_crossing_threshold_slicer/Dout] [get_bd_pins zero_crossing_a/threshold_in] [get_bd_pins zero_crossing_b/threshold_in]
connect_bd_net [get_bd_pins zero_crossing_thresholds_from_ps/gpio_io_o] [get_bd_pins zero_crossing_threshold_slicer/Din]

current_bd_instance /adc_processing
connect_bd_net [get_bd_pins adc_clk_n_i] [get_bd_pins clk_wiz_0/clk_in1_n]
connect_bd_net [get_bd_pins adc_clk_p_i] [get_bd_pins clk_wiz_0/clk_in1_p]
connect_bd_net -net adc_dat_a_i_1 [get_bd_pins adc_ch_a/Dout] [get_bd_pins Dout]
connect_bd_net [get_bd_pins adc_dat_a_i] [get_bd_pins axis_red_pitaya_adc_1/adc_dat_a]
connect_bd_net -net adc_dat_b_i_1 [get_bd_pins adc_ch_b/Dout] [get_bd_pins Dout1]
connect_bd_net [get_bd_pins adc_dat_b_i] [get_bd_pins axis_red_pitaya_adc_1/adc_dat_b]
connect_bd_net [get_bd_pins axis_red_pitaya_adc_1/m_axis_tdata] [get_bd_pins adc_ch_a/Din] [get_bd_pins adc_ch_b/Din]
connect_bd_net -net util_ds_buf_0_IBUF_OUT [get_bd_pins clk_wiz_0/clk_out1] [get_bd_pins clk_out1] [get_bd_pins axis_red_pitaya_adc_1/aclk]

current_bd_instance /led_indicator
connect_bd_intf_net [get_bd_intf_pins S_AXI] [get_bd_intf_pins led_select_from_ps/S_AXI]
connect_bd_net -net LateralControl_0_max_sensor_state [get_bd_pins in_lat_max_sensor] [get_bd_pins led_status_indicators_0/in_lat_max_sensor]
connect_bd_net -net LateralControl_0_zero_sensor_state [get_bd_pins in_lat_min_sensor] [get_bd_pins led_status_indicators_0/in_lat_min_sensor]
connect_bd_net [get_bd_pins in_lat_running] [get_bd_pins led_status_indicators_0/in_lat_running]
connect_bd_net [get_bd_pins in_rot_running] [get_bd_pins led_status_indicators_0/in_rot_running]
connect_bd_net [get_bd_pins led_select_from_ps/gpio2_io_o] [get_bd_pins led_status_indicators_0/cfg_1]
connect_bd_net [get_bd_pins led_select_from_ps/gpio_io_o] [get_bd_pins led_status_indicators_0/cfg_0]
connect_bd_net [get_bd_pins led_status_indicators_0/leds] [get_bd_pins leds]
connect_bd_net -net msb_select_0_msb [get_bd_pins heartbeat_clk/msb] [get_bd_pins led_status_indicators_0/in_heartbeat]
connect_bd_net [get_bd_pins rot_zero_in] [get_bd_pins led_status_indicators_0/in_rot_sensor]
connect_bd_net [get_bd_pins s_axi_aresetn] [get_bd_pins led_select_from_ps/s_axi_aresetn]
connect_bd_net -net util_ds_buf_0_IBUF_OUT [get_bd_pins CLK] \
  [get_bd_pins heartbeat_clk/CLK] [get_bd_pins led_select_from_ps/s_axi_aclk] [get_bd_pins led_status_indicators_0/clk]

current_bd_instance /led_indicator/heartbeat_clk
connect_bd_net [get_bd_pins c_counter_binary_0/Q] [get_bd_pins msb_select_0/counter]
connect_bd_net [get_bd_pins msb_select_0/msb] [get_bd_pins msb]
connect_bd_net -net util_ds_buf_0_IBUF_OUT [get_bd_pins CLK] [get_bd_pins c_counter_binary_0/CLK]

current_bd_instance /
connect_bd_intf_net [get_bd_intf_pins PS/M01_AXI] [get_bd_intf_pins Thresholding/S_AXI3]
connect_bd_intf_net [get_bd_intf_pins PS/M03_AXI] [get_bd_intf_pins Thresholding/S_AXI2]
connect_bd_intf_net [get_bd_intf_pins PS/M04_AXI] [get_bd_intf_pins pulse_processing_wip/S_AXI]
connect_bd_intf_net [get_bd_intf_pins PS/M05_AXI] [get_bd_intf_pins lateral_controls/S_AXI]
connect_bd_intf_net [get_bd_intf_pins PS/M06_AXI] [get_bd_intf_pins lateral_controls/S_AXI1]
connect_bd_intf_net [get_bd_intf_pins PS/M07_AXI] [get_bd_intf_pins rotational_controls/S_AXI]
connect_bd_intf_net [get_bd_intf_pins PS/M08_AXI] [get_bd_intf_pins rotational_controls/S_AXI1]
connect_bd_intf_net [get_bd_intf_pins PS/M09_AXI] [get_bd_intf_pins Thresholding/S_AXI]
connect_bd_intf_net [get_bd_intf_pins PS/M10_AXI] [get_bd_intf_pins Thresholding/S_AXI1]
connect_bd_intf_net [get_bd_intf_pins PS/M11_AXI] [get_bd_intf_pins led_indicator/S_AXI]
connect_bd_intf_net [get_bd_intf_pins PS/M12_AXI] [get_bd_intf_pins Thresholding/S_AXI4]
connect_bd_intf_net [get_bd_intf_pins dac_select_0/m_axis] [get_bd_intf_pins dac_module/s_axis]
connect_bd_intf_net -intf_net processing_system7_0_DDR [get_bd_intf_ports DDR] [get_bd_intf_pins PS/DDR]
connect_bd_intf_net -intf_net processing_system7_0_FIXED_IO [get_bd_intf_ports FIXED_IO] [get_bd_intf_pins PS/FIXED_IO]
connect_bd_net -net LateralControl_0_max_sensor_state [get_bd_pins lateral_controls/max_sensor_state] [get_bd_pins led_indicator/in_lat_max_sensor]
connect_bd_net -net LateralControl_0_motor_dir [get_bd_pins lateral_controls/lat_dir_out] [get_bd_ports lat_dir_out]
connect_bd_net -net LateralControl_0_motor_pulses [get_bd_pins lateral_controls/lat_drive_out] [get_bd_ports lat_drive_out]
connect_bd_net -net LateralControl_0_zero_sensor_state [get_bd_pins lateral_controls/zero_sensor_state] [get_bd_pins led_indicator/in_lat_min_sensor]
connect_bd_net [get_bd_pins PS/gpio2_io_o1] [get_bd_pins dac_select_0/sel_2]
connect_bd_net [get_bd_pins PS/gpio_io_o5] [get_bd_pins dac_select_0/sel_1]
connect_bd_net [get_bd_pins PS/peripheral_aresetn] \
  [get_bd_pins lateral_controls/s_axi_aresetn] [get_bd_pins rotational_controls/s_axi_aresetn] \
  [get_bd_pins Thresholding/s_axi_aresetn] [get_bd_pins pulse_processing_wip/s_axi_aresetn] \
  [get_bd_pins led_indicator/s_axi_aresetn]
connect_bd_net [get_bd_pins Thresholding/coinc_for_dac] [get_bd_pins dac_select_0/InD]
connect_bd_net [get_bd_pins Thresholding/over_sig] [get_bd_pins dac_select_0/InF]
connect_bd_net [get_bd_pins Thresholding/over_sig1] [get_bd_pins dac_select_0/InE]
connect_bd_net [get_bd_pins Thresholding/sig_out] [get_bd_pins dac_select_0/In13]
connect_bd_net [get_bd_pins Thresholding/th_sig] [get_bd_pins dac_select_0/InB]
connect_bd_net [get_bd_pins Thresholding/th_sig1] [get_bd_pins dac_select_0/InC]
connect_bd_net [get_bd_ports adc_clk_n_i] [get_bd_pins adc_processing/adc_clk_n_i]
connect_bd_net [get_bd_ports adc_clk_p_i] [get_bd_pins adc_processing/adc_clk_p_i]
connect_bd_net -net adc_dat_a_i_1 [get_bd_pins adc_processing/Dout] \
  [get_bd_pins constant_fraction_discriminator_wip/sig_in_a] [get_bd_pins Thresholding/sig_in] [get_bd_pins dac_select_0/In0]
connect_bd_net [get_bd_ports adc_dat_a_i] [get_bd_pins adc_processing/adc_dat_a_i]
connect_bd_net -net adc_dat_b_i_1 [get_bd_pins adc_processing/Dout1] \
  [get_bd_pins constant_fraction_discriminator_wip/sig_in_b] [get_bd_pins Thresholding/sig_in1] \
  [get_bd_pins dac_select_0/In1]
connect_bd_net [get_bd_ports adc_dat_b_i] [get_bd_pins adc_processing/adc_dat_b_i]
connect_bd_net -net axi_gpio_1_gpio2_io_o [get_bd_pins Thresholding/gpio2_io_o] [get_bd_pins dac_select_0/In3]
connect_bd_net -net axi_gpio_1_gpio_io_o [get_bd_pins Thresholding/gpio_io_o] [get_bd_pins dac_select_0/In2]
connect_bd_net -net axis_red_pitaya_dac_0_dac_clk [get_bd_pins dac_module/dac_clk_o] [get_bd_ports dac_clk_o]
connect_bd_net -net axis_red_pitaya_dac_0_dac_dat [get_bd_pins dac_module/dac_dat_o] [get_bd_ports dac_dat_o]
connect_bd_net -net axis_red_pitaya_dac_0_dac_rst [get_bd_pins dac_module/dac_rst_o] [get_bd_ports dac_rst_o]
connect_bd_net -net axis_red_pitaya_dac_0_dac_sel [get_bd_pins dac_module/dac_sel_o] [get_bd_ports dac_sel_o]
connect_bd_net -net axis_red_pitaya_dac_0_dac_wrt [get_bd_pins dac_module/dac_wrt_o] [get_bd_ports dac_wrt_o]
connect_bd_net -net constant_fraction_discriminator_Dout [get_bd_pins constant_fraction_discriminator_wip/Dout] [get_bd_pins dac_select_0/In4]
connect_bd_net -net constant_fraction_discriminator_delay_sig_out_a [get_bd_pins constant_fraction_discriminator_wip/delay_sig_out_a] \
  [get_bd_pins dac_select_0/In5]
connect_bd_net -net constant_fraction_discriminator_delay_sig_out_b [get_bd_pins constant_fraction_discriminator_wip/delay_sig_out_b] \
  [get_bd_pins dac_select_0/In6]
connect_bd_net -net constant_fraction_discriminator_sig_out [get_bd_pins constant_fraction_discriminator_wip/sig_out_a] \
  [get_bd_pins dac_select_0/In7] [get_bd_pins pulse_processing_wip/sig_in]
connect_bd_net -net constant_fraction_discriminator_sig_out1 [get_bd_pins constant_fraction_discriminator_wip/sig_out_b] \
  [get_bd_pins dac_select_0/In8] [get_bd_pins pulse_processing_wip/sig_in1]
connect_bd_net -net delay_value_1 [get_bd_pins PS/gpio_io_o3] [get_bd_pins constant_fraction_discriminator_wip/delay_value]
connect_bd_net [get_bd_ports lat_max_in] [get_bd_pins lateral_controls/lat_max_in]
connect_bd_net [get_bd_ports lat_min_in] [get_bd_pins lateral_controls/lat_min_in]
connect_bd_net [get_bd_pins lateral_controls/Dout] [get_bd_pins led_indicator/in_lat_running]
connect_bd_net -net led_status_indicators_0_leds [get_bd_pins led_indicator/leds] [get_bd_ports leds]
connect_bd_net -net overthreshold_from_ps_gpio_io_o [get_bd_pins Thresholding/gpio_io_o1] [get_bd_pins dac_select_0/In10]
connect_bd_net [get_bd_pins pulse_processing_wip/crossing_sig] [get_bd_pins dac_select_0/InA]
connect_bd_net [get_bd_pins pulse_processing_wip/crossing_sig1] [get_bd_pins dac_select_0/In9]
connect_bd_net [get_bd_pins pulse_processing_wip/sig_out] [get_bd_pins dac_select_0/In12]
connect_bd_net [get_bd_pins pulse_processing_wip/sig_out1] [get_bd_pins dac_select_0/In11]
connect_bd_net [get_bd_ports rot_zero_in] [get_bd_pins rotational_controls/rot_zero_in] [get_bd_pins led_indicator/rot_zero_in]
connect_bd_net [get_bd_pins rotational_controls/rot_dir_out] [get_bd_ports rot_dir_out]
connect_bd_net [get_bd_pins rotational_controls/rot_drive_out] [get_bd_ports rot_drive_out]
connect_bd_net [get_bd_pins rotational_controls/rot_is_running] [get_bd_pins led_indicator/in_rot_running]
connect_bd_net -net util_ds_buf_0_IBUF_OUT [get_bd_pins adc_processing/clk_out1] \
  [get_bd_pins dac_module/aclk] [get_bd_pins constant_fraction_discriminator_wip/clk] [get_bd_pins Thresholding/clk] \
  [get_bd_pins PS/ACLK] [get_bd_pins lateral_controls/clk] [get_bd_pins rotational_controls/clk] \
  [get_bd_pins dac_select_0/clk] [get_bd_pins pulse_processing_wip/clk] [get_bd_pins led_indicator/CLK]

# ---- address map ----
assign_bd_address -offset 0x40000000 -range 64K -target_address_space [get_bd_addr_spaces PS/processing_system7_0/Data] [get_bd_addr_segs lateral_controls/lat_control_from_ps/S_AXI/Reg]
assign_bd_address -offset 0x40010000 -range 64K -target_address_space [get_bd_addr_spaces PS/processing_system7_0/Data] [get_bd_addr_segs lateral_controls/lat_sig_from_pl/S_AXI/Reg]
assign_bd_address -offset 0x40020000 -range 64K -target_address_space [get_bd_addr_spaces PS/processing_system7_0/Data] [get_bd_addr_segs PS/output_select_from_ps/S_AXI/Reg]
assign_bd_address -offset 0x40030000 -range 64K -target_address_space [get_bd_addr_spaces PS/processing_system7_0/Data] [get_bd_addr_segs Thresholding/overthreshold/overthreshold_from_ps/S_AXI/Reg]
assign_bd_address -offset 0x40040000 -range 64K -target_address_space [get_bd_addr_spaces PS/processing_system7_0/Data] [get_bd_addr_segs PS/signal_delay_from_ps/S_AXI/Reg]
assign_bd_address -offset 0x40050000 -range 64K -target_address_space [get_bd_addr_spaces PS/processing_system7_0/Data] [get_bd_addr_segs Thresholding/thresholds_from_ps/S_AXI/Reg]
assign_bd_address -offset 0x40060000 -range 64K -target_address_space [get_bd_addr_spaces PS/processing_system7_0/Data] [get_bd_addr_segs pulse_processing_wip/zero_crossing_thresholds_from_ps/S_AXI/Reg]
assign_bd_address -offset 0x40070000 -range 64K -target_address_space [get_bd_addr_spaces PS/processing_system7_0/Data] [get_bd_addr_segs rotational_controls/rot_control_from_ps/S_AXI/Reg]
assign_bd_address -offset 0x40080000 -range 64K -target_address_space [get_bd_addr_spaces PS/processing_system7_0/Data] [get_bd_addr_segs rotational_controls/rot_sig_from_pl/S_AXI/Reg]
assign_bd_address -offset 0x40090000 -range 64K -target_address_space [get_bd_addr_spaces PS/processing_system7_0/Data] [get_bd_addr_segs Thresholding/coinc_control_from_ps/S_AXI/Reg]
assign_bd_address -offset 0x40100000 -range 64K -target_address_space [get_bd_addr_spaces PS/processing_system7_0/Data] [get_bd_addr_segs Thresholding/coinc_counts_from_pl/S_AXI/Reg]
assign_bd_address -offset 0x40110000 -range 64K -target_address_space [get_bd_addr_spaces PS/processing_system7_0/Data] [get_bd_addr_segs led_indicator/led_select_from_ps/S_AXI/Reg]
assign_bd_address -offset 0x40120000 -range 64K -target_address_space [get_bd_addr_spaces PS/processing_system7_0/Data] [get_bd_addr_segs Thresholding/timeout_settings_from_ps/S_AXI/Reg]

validate_bd_design
save_bd_design
